# EAGLE design deskaBezESP (EAGLE 9.1.3)
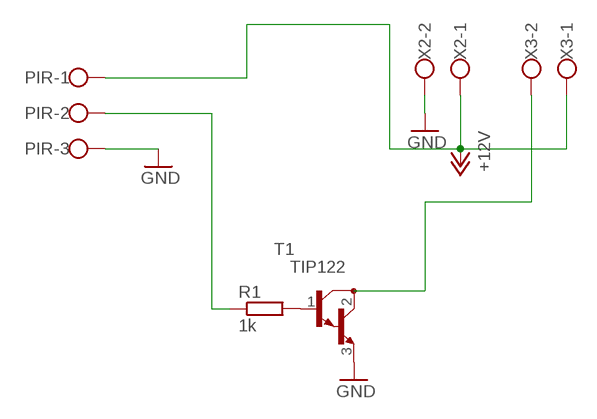
[diagram p0: schematic, sheet 1]

## Parts
PIR  W237-103  [W237-103]
R1  1k  R-EU_0207/10  [0207/10]
T1  TIP122  [TO220]
X2  W237-102  [W237-102]
X3  W237-102  [W237-102]

## Nets
+12V: PIR.1 X2.1 X3.1
GND: PIR.3 T1.3(E) X2.2
N$1: T1.2(C) X3.2
N$4: R1.2 T1.1(B)
PIROUT: PIR.2 R1.1

## Library data of the parts
PIR = con-wago-500:W237-103: WAGO SCREW CLAMP; MPN: 237-103; OC_FARNELL: unknown; OC_NEWARK: 18M7116
R1 = rcl:R-EU_: RESISTOR, European symbol
T1 = transistor:TIP122: NPN BIPOLAR DARLINGTON TRANSISTOR
X2 X3 = con-wago-500:W237-102: WAGO SCREW CLAMP; MPN: 237-102; OC_FARNELL: unknown; OC_NEWARK: 70K9898

## Board
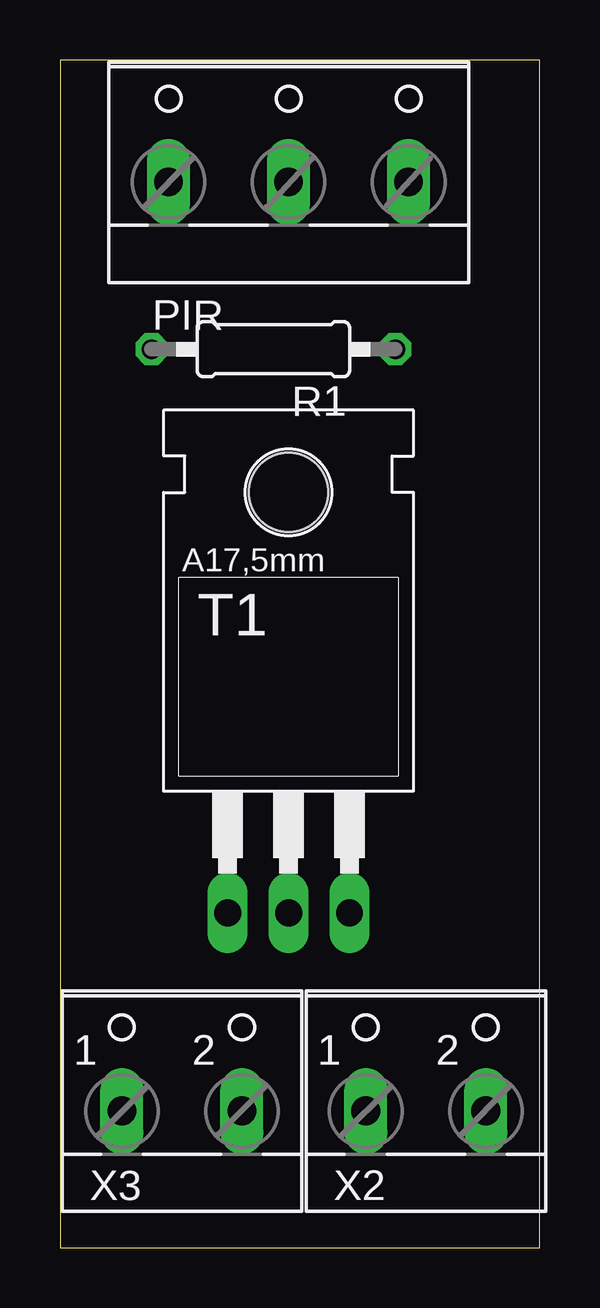
[diagram p1: board, top side]
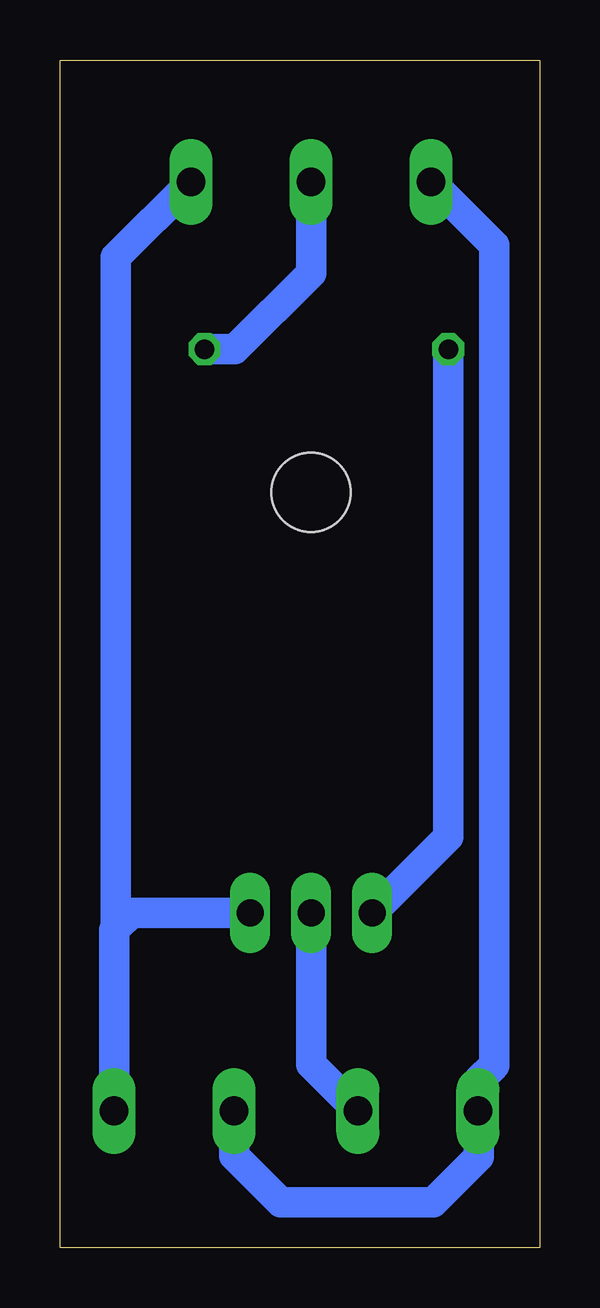
[diagram p2: board, bottom side, seen from below]

Size 19.99 x 49.52 mm. Coordinates in mm from the lower left corner, seen from the top.
Outline: 0,0 19.99,0 19.99,49.52 0,49.52 0,0
Copper layers (1*16): Top 0.035mm / dielectric 1.5mm / Bottom 0.035mm
Design rules "default": minimum track width 10mil, minimum drill 24mil, track to track 8mil, track to pad 8mil, pad to pad 8mil, via to via 8mil, smd to smd 8mil, copper to edge 40mil, drill to drill 8mil, minimum pad ring 10mil, minimum via ring 8mil, stop-mask expansion 4mil, vias tented up to drill 0mil, thermal gap 10mil

### Footprints (pad centres in the part's own frame; a part is rotated, then mirrored left to right if it is on the bottom)
W237-103 = drill 1.194 long: 1 -5,-1.29; 2 0,-1.29; 3 5,-1.29
0207/10 = drill 0.813 octagon: 1 -5.08,0; 2 5.08,0
TO220 = drill 1.118 long: 1 -2.54,-6.35; 2 0,-6.35; 3 2.54,-6.35 | hole 3.302: 0,11.176
W237-102 = drill 1.194 long: 1 -2.5,-1.27; 2 2.5,-1.27

### Placement (x,y rotation side)
PIR  9.53,45.72 0 top
R1  8.89,37.47 180 top
T1  9.53,20.32 0 top
X2  15.24,6.99 0 top
X3  5.08,6.99 0 top

### Tracks (layer width: path | path; a pad name or v marks a point on that pad's centre or on a via)
+12V
  Bottom 1.27: X2.1 12.74,3.85 10.79,1.91 4.45,1.91 2.54,3.81 2.54,5.67 X3.1 2.58,6.95 1.91,7.62 1.91,41.81 PIR.1
GND
  Bottom 1.27: PIR.3 17.66,41.3 17.66,34.92 17.66,13.34 | T1.3 17.02,13.97 17.66,13.34 | X2.2 17.74,13.26 17.66,13.34
N$1
  Bottom 1.27: X3.2 9.53,7.66 T1.2
N$4
  Bottom 1.27: R1.2 3.81,17.14 T1.1
PIROUT
  Bottom 1.27: PIR.2 9.53,40.64 12.7,37.47 R1.1